# Altium project HAB-Payload-Card-Template.PrjPcb
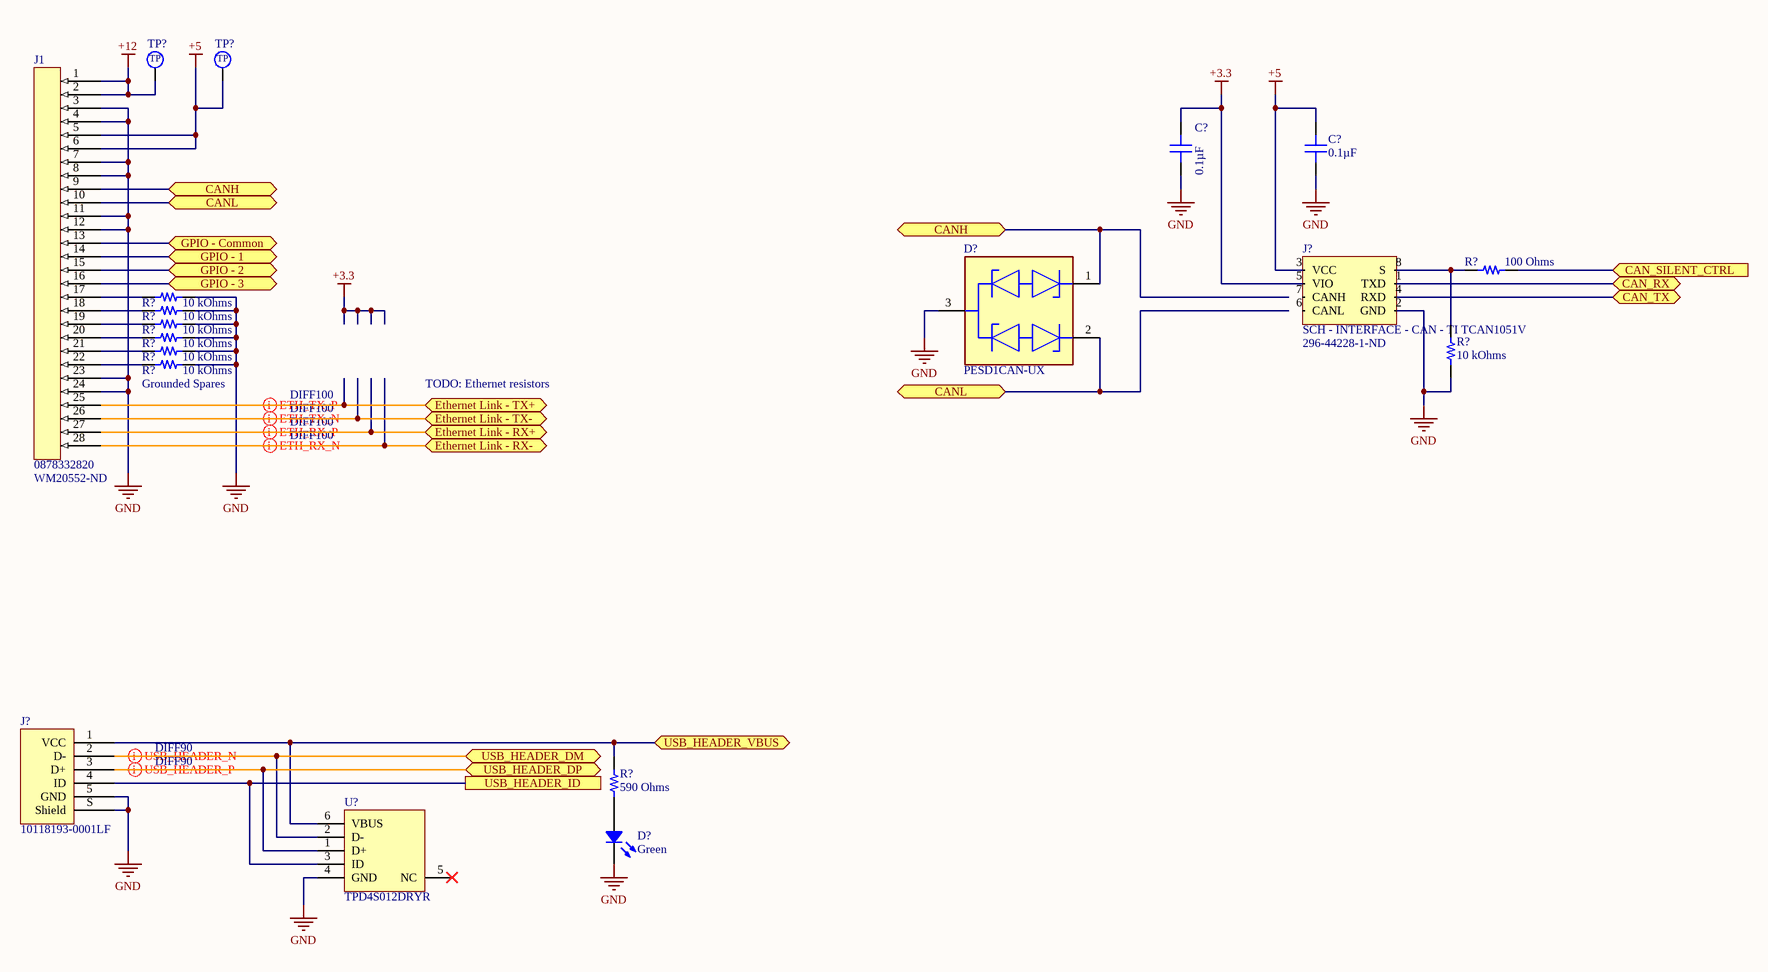
[diagram p0: Payload-Card-Template.SchDoc]
3 sheets, 67 parts. Net scope: flat (ports and power ports of the same name join across sheets).
Board file: Payload-Card-Template.PcbDoc
Sheets:
  Payload-Card-Template.SchDoc
  Microcontroller.SchDoc
  Power-Supplies.SchDoc

## Sheet Payload-Card-Template.SchDoc
size A3; Organization: Altium Limited; Address1: L3, 12a Rodborough Rd; Address2: Frenchs Forest; Address3: NSW; Address4: Australia 2086

### Parts
(Parts that share a designator on the sheet are numbered #1, #2 ... from top to bottom, then left to right.)
C?#1  0.1µF  [CAP 0603_1608]
C?#2  0.1µF  [CAP 0603_1608]
D?#1  PESD1CAN-UX  [FP-SOT323-MFG]
D?#2  Green  [LED 0603_1608 GREEN]
J1  0878332820  Supplier Part Number 1: WM20552-ND  [0878332820]
J?#1  SCH - INTERFACE - CAN - TI TCAN1051V  Supplier Part Number 1: 296-44228-1-ND
J?#2  10118193-0001LF  [FCI USB 10118193-0001LF]
R?#1  100 Ohms  [RES 0603_1608]
R?#2  10 kOhms  [RES 0603_1608]
R?#3  10 kOhms  [RES 0603_1608]
R?#4  10 kOhms  [RES 0603_1608]
R?#5  10 kOhms  [RES 0603_1608]
R?#6  10 kOhms  [RES 0603_1608]
R?#7  10 kOhms  [RES 0603_1608]
R?#8  10 kOhms  [RES 0603_1608]
R?#9  590 Ohms  [RES 0603_1608]
TP?#1  2.5mm_SMD_TestPoint  [2.5mm TestPoint]  (value not drawn)
TP?#2  2.5mm_SMD_TestPoint  [2.5mm TestPoint]  (value not drawn)
U?#1  TPD4S012DRYR  [DRY0006A]

### Ports
CAN_RX (bidir), CAN_SILENT_CTRL (in), CAN_TX (bidir), CANH (bidir), CANL (bidir), Ethernet Link - RX+ (bidir), Ethernet Link - RX- (bidir), Ethernet Link - TX+ (bidir), Ethernet Link - TX- (bidir), GPIO - 1 (bidir), GPIO - 2 (bidir), GPIO - 3 (bidir), GPIO - Common (bidir), USB_HEADER_DM (bidir), USB_HEADER_DP (bidir), USB_HEADER_ID, USB_HEADER_VBUS (bidir)

### Nets
+3.3: C?#1.2 J?#1.5(VIO)
+5: C?#2.2 J1.5 J1.6 J?#1.3(VCC) TP?#2.1
+12: J1.1 J1.2 TP?#1.1
GND: C?#1.1 C?#2.1 D?#1.3(common_cathode) D?#2.2 J1.3 J1.4 J1.7 J1.8 J1.11 J1.12 J1.23 J1.24 J?#1.2(GND) J?#2.5(GND) J?#2.S(Shield) R?#2.2 R?#3.2 R?#4.2 R?#5.2 R?#6.2 R?#7.1 R?#8.2 U?#1.4(GND)
NetD?#1_1: D?#1.1(cathode_1) J1.9 ; port CANH
NetD?#1_2: D?#1.2(cathode_2) J1.10 ; port CANL
NetD?#2_1: D?#2.1 R?#9.1
NetJ1_13: J1.13 ; port GPIO - Common
NetJ1_14: J1.14 ; port GPIO - 1
NetJ1_15: J1.15 ; port GPIO - 2
NetJ1_16: J1.16 ; port GPIO - 3
NetJ1_17: J1.17 R?#2.1
NetJ1_18: J1.18 R?#3.1
NetJ1_19: J1.19 R?#4.1
NetJ1_20: J1.20 R?#5.1
NetJ1_21: J1.21 R?#6.1
NetJ1_22: J1.22 R?#8.1
NetJ1_25: J1.25 ; port Ethernet Link - TX+
NetJ1_26: J1.26 ; port Ethernet Link - TX-
NetJ1_27: J1.27 ; port Ethernet Link - RX+
NetJ1_28: J1.28 ; port Ethernet Link - RX-
NetJ?#1_1: J?#1.1(TXD) ; port CAN_RX
NetJ?#1_4: J?#1.4(RXD) ; port CAN_TX
NetJ?#1_8: J?#1.8(S) R?#1.1 R?#7.2
NetJ?#2_1: J?#2.1(VCC) R?#9.2 U?#1.6(VBUS) ; port USB_HEADER_VBUS
NetJ?#2_2: J?#2.2(D-) U?#1.2(D-) ; port USB_HEADER_DM
NetJ?#2_3: J?#2.3(D+) U?#1.1(D+) ; port USB_HEADER_DP
NetJ?#2_4: J?#2.4(ID) U?#1.3(ID) ; port USB_HEADER_ID
NetR?#1_2: R?#1.2 ; port CAN_SILENT_CTRL

Not connected (* = marked no-connect by the designer): J?#1 6(CANL) 7(CANH); U?#1 5(NC)*

### Layout directives
differential pair; differential pair class DIFF100: NetJ1_25, NetJ1_26, NetJ1_27, NetJ1_28
differential pair; differential pair class DIFF90: NetJ?#2_2, NetJ?#2_3

### Notes on the sheet
- (near R?#8) Grounded Spares
- TODO: Ethernet resistors
- Title
- Size:
- Date:
- A3
- Number:
- Time:
- Revision:
- Sheet
- of
- File:
- (in symbol 2.5mm_SMD_TestPoint) TP

### Library data of the parts
C?#1 C?#2 = CL10B104KA8WPNC: CAP CER 0.1UF 25V X7R 0603; Manufacturer: Samsung Electro-Mechanics; Tolerance: ±10%; Part Number: CL10B104KA8WPNC; Value: 0.1µF; Applications: Automotive; Capacitance: 0.1µF; ComponentLink1Description: Datasheet; ComponentLink1URL: http://www.samsungsem.com/kr/support/product-search/mlcc/CL10B104KA8WPNC.jsp; ComponentLink2Description: DigiKey Link; ComponentLink2URL: http://digikey.com/product-detail/en/samsung-electro-mechanics/CL10B104KA8WPNC/1276-6717-1-ND/5961576; Device Package: 0603 (1608 Metric); Features: Open Mode; LastUpdated: 9/2/2020 1:03:30 AM; Lifecycle Status: Active; Minimum Order: 1; Mounting Type: Surface Mount, MLCC; Operating Temperature: -55°C ~ 125°C; Package / Case: 0603 (1608 Metric); Packaging: TapeAndReel; PartId: 5631; Part Status: Active; Price: 0.02; Ratings: AEC-Q200; Series: CL; Size / Dimension: 0.063" L x 0.031" W (1.60mm x 0.80mm); Supplier 1: DigiKey; Supplier Part Number 1: 1276-6717-1-ND; Temperature Coefficient: X7R; Thickness (Max): 0.035" (0.90mm); Voltage - Rated: 25V
D?#1 = CMP-14436-000006-1: TVS DIODE 24V 50V SC70-3
D?#2 = LTST-C193KGKT-5A: LED GREEN CLEAR CHIP SMD; Manufacturer: Lite-On Inc.; Configuration: Standard; Current - Test: 5mA; Lens Color: Colorless; Lens Size: 1.15mm x 0.80mm; Lens Style: Rectangle with Flat Top; Millicandela Rating: 16.25mcd; Viewing Angle: 130°; Voltage - Forward (Vf) (Typ): 2V; Wavelength - Dominant: 572nm; Wavelength - Peak: 574nm; Part Number: LTST-C193KGKT-5A; Color: Green; ComponentLink1Description: Datasheet; ComponentLink1URL: http://optoelectronics.liteon.com/upload/download/DS22-2007-0094/LTST-C193KGKT-5A.PDF; ComponentLink2Description: DigiKey Link; ComponentLink2URL: http://digikey.com/product-detail/en/lite-on-inc/LTST-C193KGKT-5A/160-1828-1-ND/2356247; Device Package: 0603 (1608 Metric); Height (Max): 0.45mm; LastUpdated: 9/2/2020 1:20:41 AM; Lens Transparency: Clear; Lifecycle Status: Active; Minimum Order: 1; Mounting Type: Surface Mount; Package / Case: 0603 (1608 Metric); Packaging: TapeAndReel; PartId: 694; Part Status: Active; Price: 0.06; Series: -; Size / Dimension: 1.60mm L x 0.80mm W; Supplier 1: DigiKey; Supplier Part Number 1: 160-1828-1-ND; Supplier Device Package: Chip LED; Value: Green
J?#2 = 10118193-0001LF: CONN RCPT USB2.0 MICRO B SMD R/A; Manufacturer: Amphenol ICC (FCI); Connector Type: USB - micro B; Current Rating (Amps): 1.8A per Contact; Gender: Receptacle; Mating Cycles: 10000; Number of Contacts: 5; Number of Ports: 1; Shielding: Shielded; Voltage - Rated: 100VAC; Part Number: 10118193-0001LF; ComponentLink1Description: Datasheet; ComponentLink1URL: https://cdn.amphenol-icc.com/media/wysiwyg/files/documentation/datasheet/inputoutput/io_usb_micro.pdf; ComponentLink2Description: DigiKey Link; ComponentLink2URL: //digikey.com/product-detail/en/amphenol-icc-fci/10118193-0001LF/609-4616-2-ND/2785388; Features: Solder Retention; LastUpdated: 12/9/2019 8:51:28 PM; Lifecycle Status: 0; Minimum Order: 1; Mounting Feature: Horizontal; Mounting Type: Surface Mount, Right Angle; Through Hole; Operating Temperature: -30°C ~ 80°C; Packaging: TapeAndReel; Part Status: Active; Price: 0.21; Series: -; Specifications: USB 2.0; Supplier 1: DigiKey; Supplier Part Number 1: 609-4616-2-ND; Termination: Solder
R?#1 = RMCF0603FG100R: RES 100 OHM 1% 1/10W 0603; Manufacturer: Stackpole Electronics Inc; Power (Watts): 0.1W, 1/10W; Temperature Coefficient: ±100ppm/°C; Part Number: RMCF0603FG100R; Value: 100 Ohms; ComponentLink1Description: Datasheet; ComponentLink1URL: https://www.seielect.com/catalog/sei-rmcf_rmcp.pdf; ComponentLink2Description: DigiKey Link; ComponentLink2URL: http://digikey.com/product-detail/en/stackpole-electronics-inc/RMCF0603FG100R/RMCF0603FG100RCT-ND/4425033; Composition: Thick Film; Device Package: 0603 (1608 Metric); Features: Automotive AEC-Q200; Height - Seated (Max): 0.022" (0.55mm); LastUpdated: 9/2/2020 1:09:39 AM; Lifecycle Status: Active; Minimum Order: 1; Number of Terminations: 2; Operating Temperature: -55°C ~ 155°C; Package / Case: 0603 (1608 Metric); Packaging: CutTape; PartId: 24036; Part Status: Active; Price: 0.10; Ratings: AEC-Q200; Resistance: 100 Ohms; Series: RMCF; Size / Dimension: 0.061" L x 0.031" W (1.55mm x 0.80mm); Supplier 1: DigiKey; Supplier Part Number 1: RMCF0603FG100RCT-ND; Supplier Device Package: 0603; Tolerance: ±1%
R?#2-R?#6 R?#8 = RMCF0603JT10K0: RES 10K OHM 5% 1/10W 0603; Manufacturer: Stackpole Electronics Inc; Power (Watts): 0.1W, 1/10W; Temperature Coefficient: ±200ppm/°C; Part Number: RMCF0603JT10K0; Value: 10 kOhms; ComponentLink1Description: Datasheet; ComponentLink1URL: https://www.seielect.com/catalog/sei-packaging.pdf; ComponentLink2Description: DigiKey Link; ComponentLink2URL: http://digikey.com/product-detail/en/stackpole-electronics-inc/RMCF0603JT10K0/RMCF0603JT10K0CT-ND/1943191; Composition: Thick Film; Device Package: 0603 (1608 Metric); Features: Automotive AEC-Q200; Height - Seated (Max): 0.022" (0.55mm); LastUpdated: 8/30/2020 8:48:45 PM; Lifecycle Status: Active; Minimum Order: 1; Number of Terminations: 2; Operating Temperature: -55°C ~ 155°C; Package / Case: 0603 (1608 Metric); Packaging: CutTape; PartId: 25659; Part Status: Active; Price: 0.10; Ratings: AEC-Q200; Resistance: 10 kOhms; Series: RMCF; Size / Dimension: 0.061" L x 0.031" W (1.55mm x 0.80mm); Supplier 1: DigiKey; Supplier Part Number 1: RMCF0603JT10K0CT-ND; Supplier Device Package: 0603; Tolerance: ±5%
R?#7 = RNCP0603FTD10K0: RES 10K OHM 1% 1/8W 0603; Manufacturer: Stackpole Electronics Inc; Power (Watts): 0.125W, 1/8W; Temperature Coefficient: ±100ppm/°C; Part Number: RNCP0603FTD10K0; Value: 10 kOhms; ComponentLink1Description: Datasheet; ComponentLink1URL: https://www.seielect.com/catalog/sei-rncp.pdf; ComponentLink2Description: DigiKey Link; ComponentLink2URL: http://digikey.com/product-detail/en/stackpole-electronics-inc/RNCP0603FTD10K0/RNCP0603FTD10K0CT-ND/2240478; Composition: Thin Film; Device Package: 0603 (1608 Metric); Features: Anti-Sulfur, Moisture Resistant; Height - Seated (Max): 0.020" (0.50mm); LastUpdated: 9/2/2020 1:09:45 AM; Lifecycle Status: Active; Minimum Order: 1; Number of Terminations: 2; Operating Temperature: -55°C ~ 155°C; Package / Case: 0603 (1608 Metric); Packaging: TapeAndReel; PartId: 22616; Part Status: Active; Price: 0.01; Resistance: 10 kOhms; Series: RNCP; Size / Dimension: 0.059" L x 0.031" W (1.50mm x 0.80mm); Supplier 1: DigiKey; Supplier Part Number 1: RNCP0603FTD10K0CT-ND; Supplier Device Package: 0603; Tolerance: ±1%
R?#9 = RMCF0603FT590R: RES 590 OHM 1% 1/10W 0603; Manufacturer: Stackpole Electronics Inc; Power (Watts): 0.1W, 1/10W; Temperature Coefficient: ±100ppm/°C; Part Number: RMCF0603FT590R; Value: 590 Ohms; ComponentLink1Description: Datasheet; ComponentLink1URL: https://www.seielect.com/catalog/sei-rmcf_rmcp.pdf; ComponentLink2Description: DigiKey Link; ComponentLink2URL: http://digikey.com/product-detail/en/stackpole-electronics-inc/RMCF0603FT590R/RMCF0603FT590RCT-ND/2418096; Composition: Thick Film; Device Package: 0603 (1608 Metric); Features: Automotive AEC-Q200; Height - Seated (Max): 0.022" (0.55mm); LastUpdated: 9/2/2020 1:09:40 AM; Lifecycle Status: Active; Minimum Order: 1; Number of Terminations: 2; Operating Temperature: -55°C ~ 155°C; Package / Case: 0603 (1608 Metric); Packaging: CutTape; PartId: 23847; Part Status: Active; Price: 0.10; Ratings: AEC-Q200; Resistance: 590 Ohms; Series: RMCF; Size / Dimension: 0.061" L x 0.031" W (1.55mm x 0.80mm); Supplier 1: DigiKey; Supplier Part Number 1: RMCF0603FT590RCT-ND; Supplier Device Package: 0603; Tolerance: ±1%
U?#1 = CMP-0326-00038-3: USB ESD Solution with Power Clamp, 4 Channels, -40 to +85 degC, 6-pin SON (DRY), Green (RoHS & no Sb/Br); Manufacturer: Texas Instruments; IO Capacitance(Typ)(pF): 0.8; USB High Speed: TRUE; IEC 61000-4-2 Air-Gap(+/- kV): 10; Breakdown Voltage(Min)(V): 6; PackageDescription: 6-Pin Plastic Small Outline No-Lead, 1 x 1.45 x 0.6 mm Body, 0.5 mm Pitch; ComponentLink2URL: http://www.ti.com/general/docs/lit/getliterature.tsp?genericPartNumber=TPD4S012&fileType=pdf; PackageVersion: revF, Dec-2011; ComponentLink3URL: SamplesURL:http://www.ti.com/product/tpd4s012#samples; ComponentLink2Description: Datasheet; IEC 61000-4-2 Contact(+/- kV): 10; DatasheetVersion: SLVS928A; PackageReference: DRY0006A; ComponentLink3Description: URL Link1; Mounting Technology: Surface Mount; PartNumber: TPD4S012DRYR; ComponentLink1Description: Manufacturer URL; SubFamily: ESD Solution; IO Leakage Current(nA): 10; ComponentLink1URL: http://www.ti.com/; Eco-Plan: Green (RoHS & no Sb/Br)
J1 = 0878332820: Supplier 1: Digi-Key
J?#1 = SCH - INTERFACE - CAN - TI TCAN1051V: Supplier 1: Digi-Key

## Sheet Microcontroller.SchDoc
size A2; Organization: Altium Limited; Address1: L3, 12a Rodborough Rd; Address2: Frenchs Forest; Address3: NSW; Address4: Australia 2086
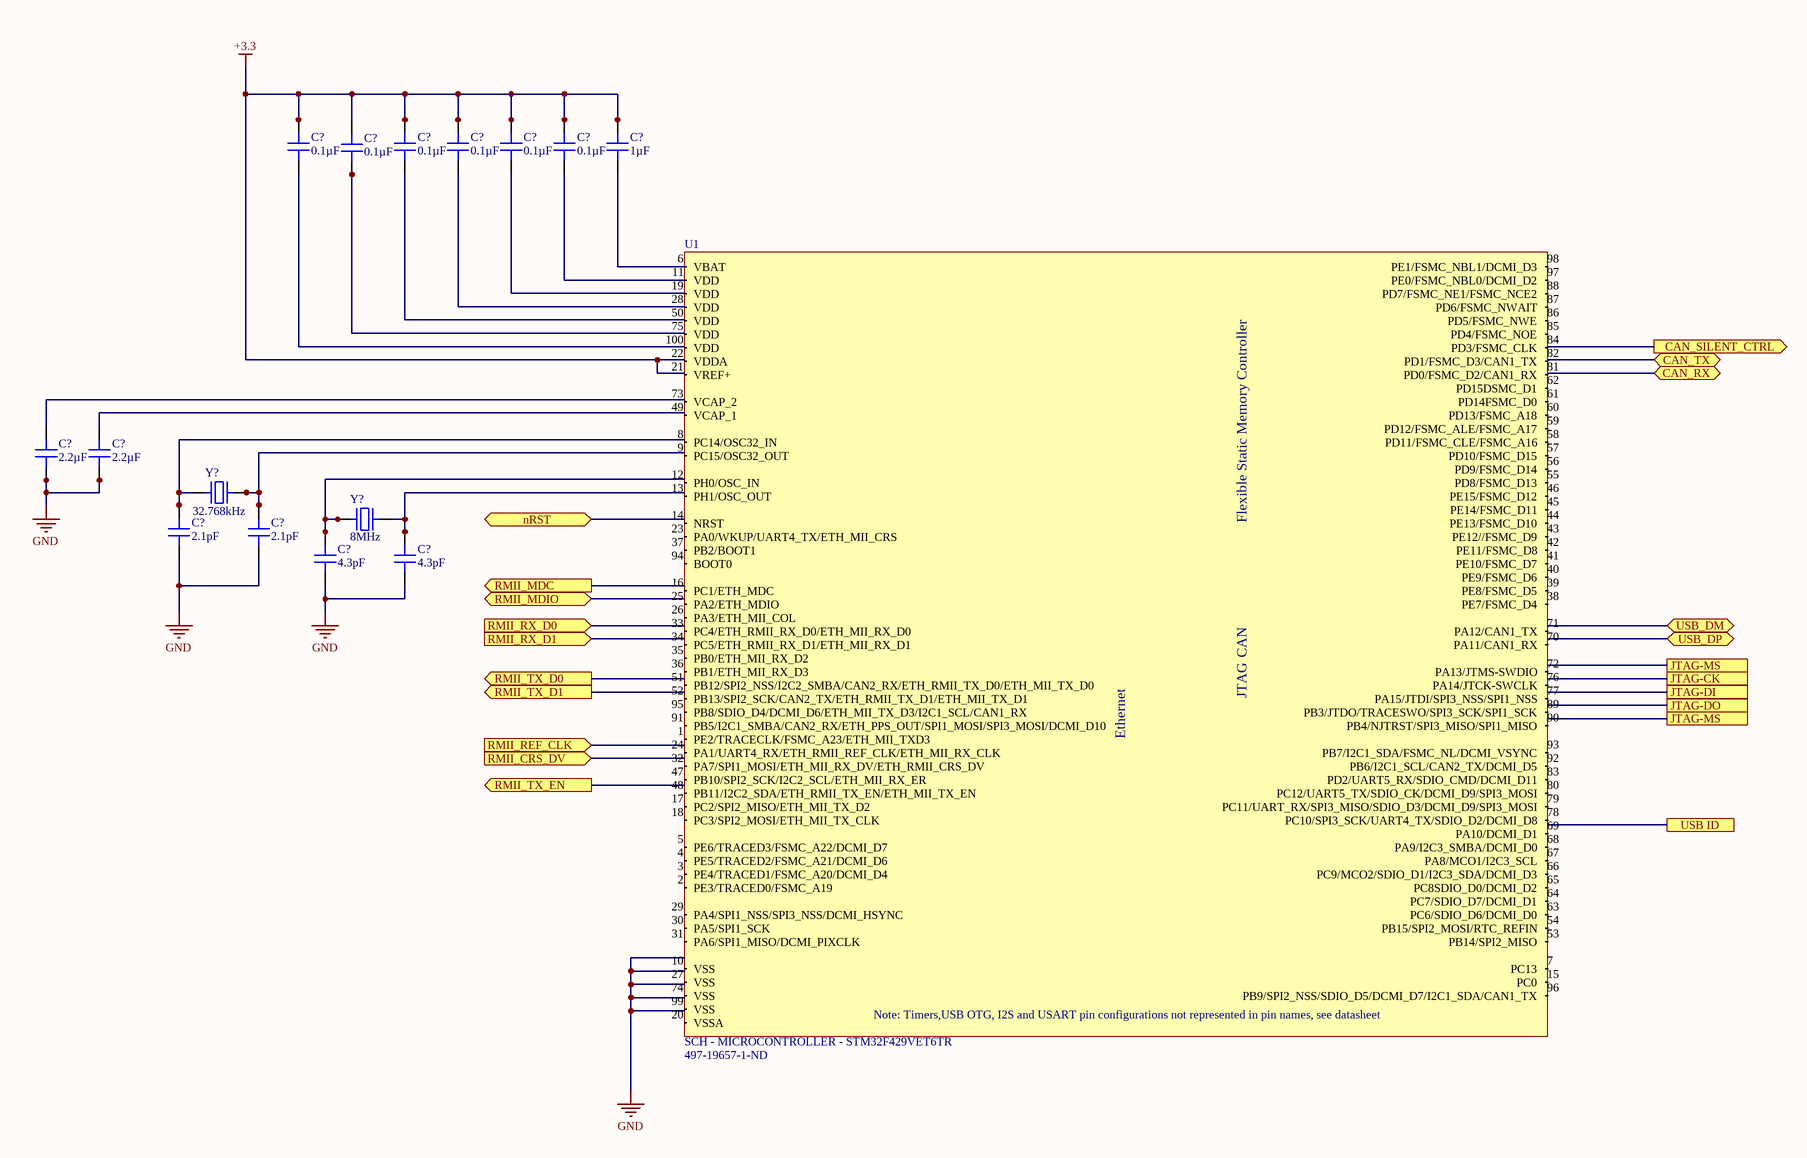
[diagram p1: Microcontroller.SchDoc]

### Parts
(Parts that share a designator on the sheet are numbered #1, #2 ... from top to bottom, then left to right.)
C?#3  0.1µF  [CAP 0603_1608]
C?#4  0.1µF  [CAP 0603_1608]
C?#5  0.1µF  [CAP 0603_1608]
C?#6  0.1µF  [CAP 0603_1608]
C?#7  0.1µF  [CAP 0603_1608]
C?#8  0.1µF  [CAP 0603_1608]
C?#9  1µF  [CAP 0603_1608]
C?#10  2.2µF  [CAP 0603_1608]
C?#11  2.2µF  [CAP 0603_1608]
C?#12  2.1pF  [CAP 0603_1608]
C?#13  2.1pF  [CAP 0603_1608]
C?#14  4.3pF  [CAP 0603_1608]
C?#15  4.3pF  [CAP 0603_1608]
U1  SCH - MICROCONTROLLER - STM32F429VET6TR  Supplier Part Number 1: 497-19657-1-ND  [PCB - LEADLESS - LQFP - ST LQFP-100 14X14MM]
Y?#1  32.768kHz  [ABRACON ABS07]
Y?#2  8MHz  [NDK NX8045GB]

### Ports
CAN_RX (bidir), CAN_SILENT_CTRL (out), CAN_TX (bidir), JTAG-CK, JTAG-DI, JTAG-DO, JTAG-MS, nRST (bidir), RMII_CRS_DV (in), RMII_MDC (out), RMII_MDIO (bidir), RMII_REF_CLK (in), RMII_RX_D0 (in), RMII_RX_D1 (in), RMII_TX_D0 (out), RMII_TX_D1 (out), RMII_TX_EN (out), USB ID, USB_DM (bidir), USB_DP (bidir)

### Nets
+3.3: C?#3.2 C?#4.2 C?#5.2 C?#6.2 C?#7.2 C?#8.2 C?#9.2
GND: C?#10.1 C?#11.1 C?#12.1 C?#13.1 C?#14.1 C?#15.1
NetC?#7_1: C?#7.1 U1.19(VDD)
NetC?#8_1: C?#8.1 U1.11(VDD)
NetC?#9_1: C?#9.1 U1.6(VBAT)
NetC?#12_2: C?#12.2 Y?#1.1
NetC?#13_2: C?#13.2 Y?#1.2
NetC?#14_2: C?#14.2 Y?#2.1
NetC?#15_2: C?#15.2 Y?#2.2

Not connected (* = marked no-connect by the designer): C?#3 1; C?#4 1; C?#5 1; C?#6 1; C?#10 2; C?#11 2; U1 1(PE2/TRACECLK/FSMC_A23/ETH_MII_TXD3) 2(PE3/TRACED0/FSMC_A19) 3(PE4/TRACED1/FSMC_A20/DCMI_D4) 4(PE5/TRACED2/FSMC_A21/DCMI_D6) 5(PE6/TRACED3/FSMC_A22/DCMI_D7) 7(PC13) 8(PC14/OSC32_IN) 9(PC15/OSC32_OUT) 10(VSS) 12(PH0/OSC_IN) 13(PH1/OSC_OUT) 14(NRST) 15(PC0) 16(PC1/ETH_MDC) 17(PC2/SPI2_MISO/ETH_MII_TX_D2) 18(PC3/SPI2_MOSI/ETH_MII_TX_CLK) 20(VSSA) 21(VREF+) 22(VDDA) 23(PA0/WKUP/UART4_TX/ETH_MII_CRS) 24(PA1/UART4_RX/ETH_RMII_REF_CLK/ETH_MII_RX_CLK) 25(PA2/ETH_MDIO) 26(PA3/ETH_MII_COL) 27(VSS) 28(VDD) 29(PA4/SPI1_NSS/SPI3_NSS/DCMI_HSYNC) 30(PA5/SPI1_SCK) 31(PA6/SPI1_MISO/DCMI_PIXCLK) 32(PA7/SPI1_MOSI/ETH_MII_RX_DV/ETH_RMII_CRS_DV) 33(PC4/ETH_RMII_RX_D0/ETH_MII_RX_D0) 34(PC5/ETH_RMII_RX_D1/ETH_MII_RX_D1) 35(PB0/ETH_MII_RX_D2) 36(PB1/ETH_MII_RX_D3) 37(PB2/BOOT1) 38(PE7/FSMC_D4) 39(PE8/FSMC_D5) 40(PE9/FSMC_D6) 41(PE10/FSMC_D7) 42(PE11/FSMC_D8) 43(PE12//FSMC_D9) 44(PE13/FSMC_D10) 45(PE14/FSMC_D11) 46(PE15/FSMC_D12) 47(PB10/SPI2_SCK/I2C2_SCL/ETH_MII_RX_ER) 48(PB11/I2C2_SDA/ETH_RMII_TX_EN/ETH_MII_TX_EN) 49(VCAP_1) 50(VDD) 51(PB12/SPI2_NSS/I2C2_SMBA/CAN2_RX/ETH_RMII_TX_D0/ETH_MII_TX_D0) 52(PB13/SPI2_SCK/CAN2_TX/ETH_RMII_TX_D1/ETH_MII_TX_D1) 53(PB14/SPI2_MISO) 54(PB15/SPI2_MOSI/RTC_REFIN) 55(PD8/FSMC_D13) 56(PD9/FSMC_D14) 57(PD10/FSMC_D15) 58(PD11/FSMC_CLE/FSMC_A16) 59(PD12/FSMC_ALE/FSMC_A17) 60(PD13/FSMC_A18) 61(PD14FSMC_D0) 62(PD15DSMC_D1) 63(PC6/SDIO_D6/DCMI_D0) 64(PC7/SDIO_D7/DCMI_D1) 65(PC8SDIO_D0/DCMI_D2) 66(PC9/MCO2/SDIO_D1/I2C3_SDA/DCMI_D3) 67(PA8/MCO1/I2C3_SCL) 68(PA9/I2C3_SMBA/DCMI_D0) 69(PA10/DCMI_D1) 70(PA11/CAN1_RX) 71(PA12/CAN1_TX) 72(PA13/JTMS-SWDIO) 73(VCAP_2) 74(VSS) 75(VDD) 76(PA14/JTCK-SWCLK) 77(PA15/JTDI/SPI3_NSS/SPI1_NSS) 78(PC10/SPI3_SCK/UART4_TX/SDIO_D2/DCMI_D8) 79(PC11/UART_RX/SPI3_MISO/SDIO_D3/DCMI_D9/SPI3_MOSI) 80(PC12/UART5_TX/SDIO_CK/DCMI_D9/SPI3_MOSI) 81(PD0/FSMC_D2/CAN1_RX) 82(PD1/FSMC_D3/CAN1_TX) 83(PD2/UART5_RX/SDIO_CMD/DCMI_D11) 84(PD3/FSMC_CLK) 85(PD4/FSMC_NOE) 86(PD5/FSMC_NWE) 87(PD6/FSMC_NWAIT) 88(PD7/FSMC_NE1/FSMC_NCE2) 89(PB3/JTDO/TRACESWO/SPI3_SCK/SPI1_SCK) 90(PB4/NJTRST/SPI3_MISO/SPI1_MISO) 91(PB5/I2C1_SMBA/CAN2_RX/ETH_PPS_OUT/SPI1_MOSI/SPI3_MOSI/DCMI_D10) 92(PB6/I2C1_SCL/CAN2_TX/DCMI_D5) 93(PB7/I2C1_SDA/FSMC_NL/DCMI_VSYNC) 94(BOOT0) 95(PB8/SDIO_D4/DCMI_D6/ETH_MII_TX_D3/I2C1_SCL/CAN1_RX) 96(PB9/SPI2_NSS/SDIO_D5/DCMI_D7/I2C1_SDA/CAN1_TX) 97(PE0/FSMC_NBL0/DCMI_D2) 98(PE1/FSMC_NBL1/DCMI_D3) 99(VSS) 100(VDD)

### Notes on the sheet
- Title
- Size:
- Date:
- File:
- A2
- Number:
- Time:
- Revision:
- Sheet
- of
- (in symbol SCH - MICROCONTROLLER - STM32F429VET6TR) Flexible Static Memory Controller; CAN; JTAG; Ethernet; Note: Timers,USB OTG, I2S and USART pin configurations not represented in pin names, see datasheet

### Library data of the parts
C?#3-C?#8 = VJ0603Y104KXJCW1BC: CAP CER 0.1UF 16V X7R 0603; Manufacturer: Vishay Vitramon; Tolerance: ±10%; Part Number: VJ0603Y104KXJCW1BC; Value: 0.1µF; Applications: General Purpose; Capacitance: 0.1µF; ComponentLink1Description: Datasheet; ComponentLink1URL: https://www.vishay.com/docs/28548/vjw1bcbascomseries.pdf; ComponentLink2Description: DigiKey Link; ComponentLink2URL: http://digikey.com/product-detail/en/vishay-vitramon/VJ0603Y104KXJCW1BC/720-1532-1-ND/421011; Device Package: 0603 (1608 Metric); LastUpdated: 9/2/2020 1:03:10 AM; Lifecycle Status: Active; Minimum Order: 1; Mounting Type: Surface Mount, MLCC; Operating Temperature: -55°C ~ 125°C; Package / Case: 0603 (1608 Metric); Packaging: TapeAndReel; PartId: 15347; Part Status: Active; Price: 0.03; Series: VJ; Size / Dimension: 0.063" L x 0.031" W (1.60mm x 0.80mm); Supplier 1: DigiKey; Supplier Part Number 1: 720-1532-1-ND; Temperature Coefficient: X7R; Thickness (Max): 0.035" (0.90mm); Voltage - Rated: 16V
C?#9 = GCM188R71C105KA64J: CAP CER 1UF 16V X7R 0603; Manufacturer: Murata Electronics; Tolerance: ±10%; Part Number: GCM188R71C105KA64J; Value: 1µF; Applications: Automotive; Capacitance: 1µF; ComponentLink1Description: Datasheet; ComponentLink1URL: https://www.murata.com/~/media/webrenewal/support/library/catalog/products/capacitor/mlcc/c03e.ashx?la=en-us; ComponentLink2Description: DigiKey Link; ComponentLink2URL: http://digikey.com/product-detail/en/murata-electronics/GCM188R71C105KA64J/490-12657-1-ND/5797626; Device Package: 0603 (1608 Metric); LastUpdated: 9/2/2020 1:03:14 AM; Lifecycle Status: Active; Minimum Order: 1; Mounting Type: Surface Mount, MLCC; Operating Temperature: -55°C ~ 125°C; Package / Case: 0603 (1608 Metric); Packaging: TapeAndReel; PartId: 13992; Part Status: Active; Price: 0.03; Ratings: AEC-Q200; Series: GCM; Size / Dimension: 0.063" L x 0.031" W (1.60mm x 0.80mm); Supplier 1: DigiKey; Supplier Part Number 1: 490-12657-1-ND; Temperature Coefficient: X7R; Thickness (Max): 0.035" (0.90mm); Voltage - Rated: 16V
C?#10 C?#11 = EMK107BJ225KA-T: CAP CER 2.2UF 16V X5R 0603; Manufacturer: Taiyo Yuden; Tolerance: ±10%; Part Number: EMK107BJ225KA-T; Value: 2.2µF; Applications: General Purpose; Capacitance: 2.2µF; ComponentLink1Description: Datasheet; ComponentLink1URL: https://ds.yuden.co.jp/TYCOMPAS/ut/detail?pn=EMK107BJ225KA-T  &u=M; ComponentLink2Description: DigiKey Link; ComponentLink2URL: http://digikey.com/product-detail/en/taiyo-yuden/EMK107BJ225KA-T/587-1430-1-ND/1004061; Device Package: 0603 (1608 Metric); LastUpdated: 9/2/2020 1:03:30 AM; Lifecycle Status: Active; Minimum Order: 1; Mounting Type: Surface Mount, MLCC; Operating Temperature: -55°C ~ 85°C; Package / Case: 0603 (1608 Metric); Packaging: TapeAndReel; PartId: 5619; Part Status: Active; Price: 0.02; Series: M; Size / Dimension: 0.063" L x 0.031" W (1.60mm x 0.80mm); Supplier 1: DigiKey; Supplier Part Number 1: 587-1430-1-ND; Temperature Coefficient: X5R; Thickness (Max): 0.035" (0.90mm); Voltage - Rated: 16V
C?#12 C?#13 = CBR06C219B5GAC: CAP CER RF 2.1PF 50V +/-0.1 PF C; Manufacturer: KEMET; Temperature Coefficient: C0G, NP0; Tolerance: ±0.1pF; Part Number: CBR06C219B5GAC; Value: 2.1pF; Applications: RF, Microwave, High Frequency; Capacitance: 2.1pF; ComponentLink1Description: Datasheet; ComponentLink1URL: https://api.kemet.com/component-edge/download/datasheet/CBR06C219B5GAC.pdf; ComponentLink2Description: DigiKey Link; ComponentLink2URL: http://digikey.com/product-detail/en/kemet/CBR06C219B5GAC/399-16153-1-ND/7649738; Device Package: 0603 (1608 Metric); Features: High Q, Low Loss, Ultra Low ESR; LastUpdated: 9/2/2020 1:03:15 AM; Lifecycle Status: Active; Minimum Order: 1; Mounting Type: Surface Mount, MLCC; Operating Temperature: -55°C ~ 125°C; Package / Case: 0603 (1608 Metric); Packaging: TapeAndReel; PartId: 13663; Part Status: Active; Price: 0.05; Series: CBR-SMD RF C0G; Size / Dimension: 0.063" L x 0.031" W (1.60mm x 0.80mm); Supplier 1: DigiKey; Supplier Part Number 1: 399-16153-1-ND; Thickness (Max): 0.034" (0.87mm); Voltage - Rated: 50V
C?#14 C?#15 = CBR06C439B5GAC: CAP CER RF 4.3PF 50V +/-0.1 PF C; Manufacturer: KEMET; Temperature Coefficient: C0G, NP0; Tolerance: ±0.1pF; Part Number: CBR06C439B5GAC; Value: 4.3pF; Applications: RF, Microwave, High Frequency; Capacitance: 4.3pF; ComponentLink1Description: Datasheet; ComponentLink1URL: https://api.kemet.com/component-edge/download/datasheet/CBR06C439B5GAC.pdf; ComponentLink2Description: DigiKey Link; ComponentLink2URL: http://digikey.com/product-detail/en/kemet/CBR06C439B5GAC/399-16185-1-ND/7649770; Device Package: 0603 (1608 Metric); Features: High Q, Low Loss, Ultra Low ESR; LastUpdated: 9/2/2020 1:03:25 AM; Lifecycle Status: Active; Minimum Order: 1; Mounting Type: Surface Mount, MLCC; Operating Temperature: -55°C ~ 125°C; Package / Case: 0603 (1608 Metric); Packaging: TapeAndReel; PartId: 8283; Part Status: Active; Price: 0.05; Series: CBR-SMD RF C0G; Size / Dimension: 0.063" L x 0.031" W (1.60mm x 0.80mm); Supplier 1: DigiKey; Supplier Part Number 1: 399-16185-1-ND; Thickness (Max): 0.034" (0.87mm); Voltage - Rated: 50V
Y?#1 = ABS07-166-32.768KHZ-T: IOT 32.786KHZ XTAL; Manufacturer: Abracon LLC; ESR (Equivalent Series Resistance): 70 kOhms; Frequency Tolerance: ±10ppm; Load Capacitance: 7pF; Operating Mode: Fundamental; Part Number: ABS07-166-32.768KHZ-T; ComponentLink1Description: Datasheet; ComponentLink1URL: https://abracon.com/datasheets/ABS07-166-32.768kHz-T.pdf; ComponentLink2Description: DigiKey Link; ComponentLink2URL: http://digikey.com/product-detail/en/abracon-llc/ABS07-166-32.768KHZ-T/535-14514-1-ND/8827205; Frequency: 32.768kHz; Height - Seated (Max): 0.035" (0.90mm); LastUpdated: 9/2/2020 1:21:47 AM; Lifecycle Status: Active; Minimum Order: 1; Mounting Type: Surface Mount; Operating Temperature: -40°C ~ 85°C; Package / Case: 2-SMD, No Lead; Packaging: TapeAndReel; PartId: 384; Part Status: Active; Price: 0.35; Series: ABS07; Size / Dimension: 0.126" L x 0.059" W (3.20mm x 1.50mm); Supplier 1: DigiKey; Supplier Part Number 1: 535-14514-1-ND; Type: kHz Crystal (Tuning Fork); Value: 32.768kHz
Y?#2 = NX8045GB-8.000000MHZ: CRYSTAL 8.0000MHZ 8PF SMD; Manufacturer: NDK America, Inc.; ESR (Equivalent Series Resistance): 200 Ohms; Frequency Stability: ±50ppm; Operating Mode: Fundamental; Part Number: NX8045GB-8.000000MHZ; ComponentLink1Description: Datasheet; ComponentLink1URL: //media.digikey.com/pdf/Data%20Sheets/NDK%20PDFs/NX8045GB.pdf; ComponentLink2Description: DigiKey Link; ComponentLink2URL: http://digikey.com/product-detail/en/ndk-america-inc/NX8045GB-8.000000MHZ/644-1018-1-ND/1128890; Frequency: 8MHz; Frequency Tolerance: ±50ppm; Height - Seated (Max): 0.079" (2.00mm); LastUpdated: 9/2/2020 1:22:00 AM; Lifecycle Status: Active; Load Capacitance: 8pF; Minimum Order: 1; Mounting Type: Surface Mount; Operating Temperature: -10°C ~ 70°C; Package / Case: 2-SMD, No Lead; Packaging: TapeAndReel; PartId: 653; Part Status: Active; Price: 0.30; Series: NX8045GB; Size / Dimension: 0.315" L x 0.177" W (8.00mm x 4.50mm); Supplier 1: DigiKey; Supplier Part Number 1: 644-1018-1-ND; Type: MHz Crystal; Value: 8MHz
U1 = SCH - MICROCONTROLLER - STM32F429VET6TR: Supplier 1: Digi-Key

## Sheet Power-Supplies.SchDoc
size A3; Organization: Altium Limited; Address1: L3, 12a Rodborough Rd; Address2: Frenchs Forest; Address3: NSW; Address4: Australia 2086
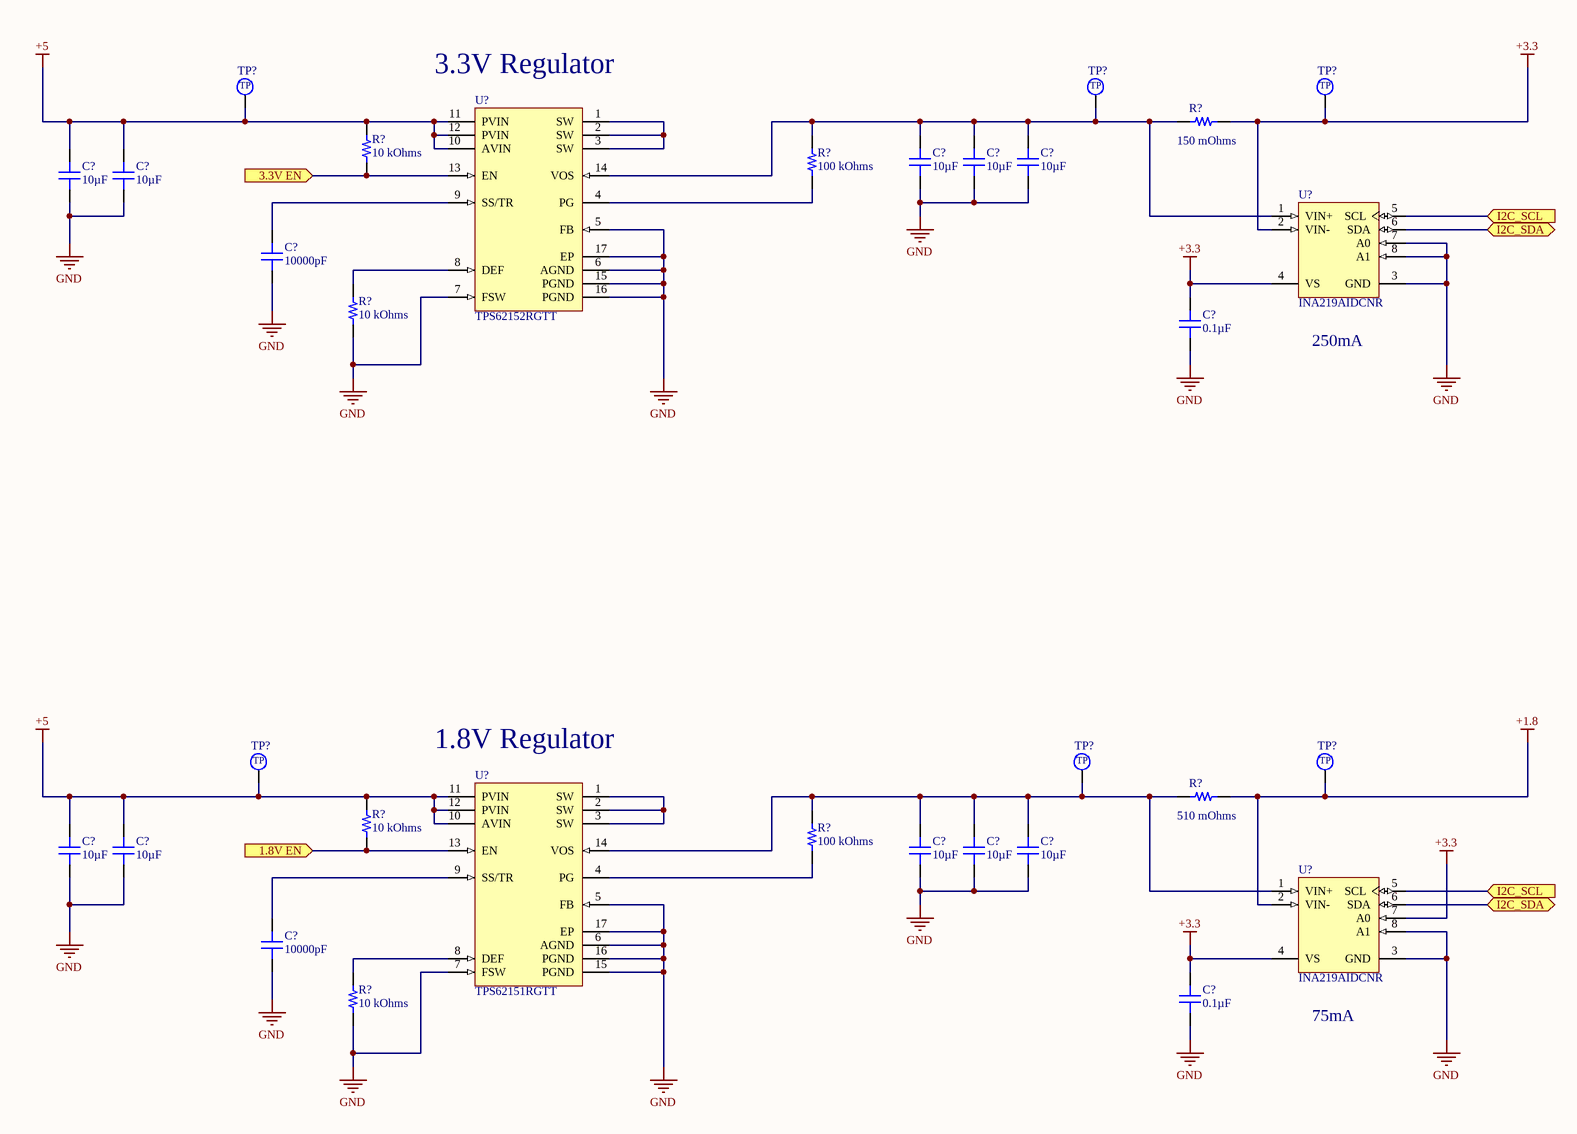
[diagram p2: Power-Supplies.SchDoc]

### Parts
(Parts that share a designator on the sheet are numbered #1, #2 ... from top to bottom, then left to right.)
C?#16  10µF  [CAP 0805_2012]
C?#17  10µF  [CAP 0805_2012]
C?#18  10µF  [CAP 0805_2012]
C?#19  10µF  [CAP 0805_2012]
C?#20  10µF  [CAP 0805_2012]
C?#21  10000pF  [CAP 0603_1608]
C?#22  0.1µF  [CAP 0603_1608]
C?#23  10µF  [CAP 0805_2012]
C?#24  10µF  [CAP 0805_2012]
C?#25  10µF  [CAP 0805_2012]
C?#26  10µF  [CAP 0805_2012]
C?#27  10µF  [CAP 0805_2012]
C?#28  10000pF  [CAP 0603_1608]
C?#29  0.1µF  [CAP 0603_1608]
R?#10  150 mOhms  [RES 0805_2012]
R?#11  10 kOhms  [RES 0603_1608]
R?#12  100 kOhms  [RES 0603_1608]
R?#13  10 kOhms  [RES 0603_1608]
R?#14  510 mOhms  [RES 0805_2012]
R?#15  10 kOhms  [RES 0603_1608]
R?#16  100 kOhms  [RES 0603_1608]
R?#17  10 kOhms  [RES 0603_1608]
TP?#3  2.5mm_SMD_TestPoint  [2.5mm TestPoint]  (value not drawn)
TP?#4  2.5mm_SMD_TestPoint  [2.5mm TestPoint]  (value not drawn)
TP?#5  2.5mm_SMD_TestPoint  [2.5mm TestPoint]  (value not drawn)
TP?#6  2.5mm_SMD_TestPoint  [2.5mm TestPoint]  (value not drawn)
TP?#7  2.5mm_SMD_TestPoint  [2.5mm TestPoint]  (value not drawn)
TP?#8  2.5mm_SMD_TestPoint  [2.5mm TestPoint]  (value not drawn)
U?#2  TPS62152RGTT  [RGT0016C_V]
U?#3  INA219AIDCNR  [DCN0008A_M]
U?#4  TPS62151RGTT  [RGT0016C_V]
U?#5  INA219AIDCNR  [DCN0008A_M]

### Ports
1.8V EN (in), 3.3V EN (in), I2C_SCL (in), I2C_SDA (bidir)

### Nets
+1.8: R?#14.2 TP?#8.1 U?#5.2(VIN-)
+3.3: C?#22.2 C?#29.2 R?#10.2 TP?#5.1 U?#3.2(VIN-) U?#3.4(VS) U?#5.4(VS) U?#5.7(A0)
+5: C?#19.2 C?#20.2 C?#23.2 C?#24.2 R?#11.2 R?#15.2 TP?#3.1 TP?#6.1 U?#2.10(AVIN) U?#2.11(PVIN) U?#2.12(PVIN) U?#4.10(AVIN) U?#4.11(PVIN) U?#4.12(PVIN)
GND: C?#16.1 C?#17.1 C?#18.1 C?#19.1 C?#20.1 C?#21.1 C?#22.1 C?#23.1 C?#24.1 C?#25.1 C?#26.1 C?#27.1 C?#28.1 C?#29.1 R?#13.1 R?#17.1 U?#2.5(FB) U?#2.6(AGND) U?#2.7(FSW) U?#2.15(PGND) U?#2.16(PGND) U?#2.17(EP) U?#3.3(GND) U?#3.7(A0) U?#3.8(A1) U?#4.5(FB) U?#4.6(AGND) U?#4.7(FSW) U?#4.15(PGND) U?#4.16(PGND) U?#4.17(EP) U?#5.3(GND) U?#5.8(A1)
NetC?#16_2: C?#16.2 C?#17.2 C?#18.2 R?#10.1 R?#12.2 TP?#4.1 U?#2.14(VOS) U?#3.1(VIN+)
NetC?#21_2: C?#21.2 U?#2.9(SS/TR)
NetC?#25_2: C?#25.2 C?#26.2 C?#27.2 R?#14.1 R?#16.2 TP?#7.1 U?#4.14(VOS) U?#5.1(VIN+)
NetC?#28_2: C?#28.2 U?#4.9(SS/TR)
NetR?#11_1: R?#11.1 U?#2.13(EN) ; port 3.3V EN
NetR?#12_1: R?#12.1 U?#2.4(PG)
NetR?#13_2: R?#13.2 U?#2.8(DEF)
NetR?#15_1: R?#15.1 U?#4.13(EN) ; port 1.8V EN
NetR?#16_1: R?#16.1 U?#4.4(PG)
NetR?#17_2: R?#17.2 U?#4.8(DEF)
NetU?#2_1: U?#2.1(SW) U?#2.2(SW) U?#2.3(SW)
NetU?#3_5: U?#3.5(SCL) U?#5.5(SCL) ; port I2C_SCL
NetU?#3_6: U?#3.6(SDA) U?#5.6(SDA) ; port I2C_SDA
NetU?#4_1: U?#4.1(SW) U?#4.2(SW) U?#4.3(SW)

### Notes on the sheet
- (near U?#2) 3.3V Regulator
- (near U?#3) 250mA
- (near U?#4) 1.8V Regulator
- (near U?#5) 75mA
- Title
- Size:
- Date:
- A3
- Number:
- Time:
- Revision:
- Sheet
- of
- File:
- (in symbol 2.5mm_SMD_TestPoint) TP

### Library data of the parts
C?#16-C?#20 C?#23-C?#27 = CC0805KKX5R7BB106: CAP CER 10UF 16V X5R 0805; Manufacturer: Yageo; Tolerance: ±10%; Part Number: CC0805KKX5R7BB106; Value: 10µF; Applications: General Purpose; Capacitance: 10µF; ComponentLink1Description: Datasheet; ComponentLink1URL: https://www.yageo.com/upload/media/product/productsearch/datasheet/mlcc/UPY-GPHC_X5R_4V-to-50V_25.pdf; ComponentLink2Description: DigiKey Link; ComponentLink2URL: http://digikey.com/product-detail/en/yageo/CC0805KKX5R7BB106/311-1865-1-ND/5195767; Device Package: 0805 (2012 Metric); LastUpdated: 9/2/2020 1:04:30 AM; Lifecycle Status: Active; Minimum Order: 1; Mounting Type: Surface Mount, MLCC; Operating Temperature: -55°C ~ 85°C; Package / Case: 0805 (2012 Metric); Packaging: TapeAndReel; PartId: 8867; Part Status: Active; Price: 0.09; Series: CC; Size / Dimension: 0.079" L x 0.049" W (2.00mm x 1.25mm); Supplier 1: DigiKey; Supplier Part Number 1: 311-1865-1-ND; Temperature Coefficient: X5R; Thickness (Max): 0.057" (1.45mm); Voltage - Rated: 16V
C?#21 C?#28 = C0603S103K4RACTU: CAP CER 10000PF 16V X7R 0603; Manufacturer: KEMET; Tolerance: ±10%; Part Number: C0603S103K4RACTU; Value: 10000pF; Applications: Boardflex Sensitive; Capacitance: 10000pF; ComponentLink1Description: Datasheet; ComponentLink1URL: https://api.kemet.com/component-edge/download/datasheet/C0603S103K4RACTU.pdf; ComponentLink2Description: DigiKey Link; ComponentLink2URL: http://digikey.com/product-detail/en/kemet/C0603S103K4RACTU/399-9135-1-ND/3522653; Device Package: 0603 (1608 Metric); Features: Floating Electrode; LastUpdated: 9/2/2020 1:03:34 AM; Lifecycle Status: Active; Minimum Order: 1; Mounting Type: Surface Mount, MLCC; Operating Temperature: -55°C ~ 125°C; Package / Case: 0603 (1608 Metric); Packaging: TapeAndReel; PartId: 3312; Part Status: Active; Price: 0.07; Series: SMD Comm X7R FE; Size / Dimension: 0.063" L x 0.031" W (1.60mm x 0.80mm); Supplier 1: DigiKey; Supplier Part Number 1: 399-9135-1-ND; Temperature Coefficient: X7R; Thickness (Max): 0.034" (0.87mm); Voltage - Rated: 16V
C?#22 C?#29 = VJ0603Y104KXJCW1BC: as C?#3 on sheet Microcontroller; Part Number: VJ0603Y104KXJCW1BC; Value: 0.1µF; Applications: General Purpose; Capacitance: 0.1µF; ComponentLink1Description: Datasheet; ComponentLink1URL: https://www.vishay.com/docs/28548/vjw1bcbascomseries.pdf; ComponentLink2Description: DigiKey Link; ComponentLink2URL: http://digikey.com/product-detail/en/vishay-vitramon/VJ0603Y104KXJCW1BC/720-1532-1-ND/421011; Device Package: 0603 (1608 Metric); LastUpdated: 9/2/2020 1:03:10 AM; Lifecycle Status: Active; Minimum Order: 1; Mounting Type: Surface Mount, MLCC; Operating Temperature: -55°C ~ 125°C; Package / Case: 0603 (1608 Metric); Packaging: TapeAndReel; PartId: 15347; Part Status: Active; Price: 0.03; Series: VJ; Size / Dimension: 0.063" L x 0.031" W (1.60mm x 0.80mm); Supplier 1: DigiKey; Supplier Part Number 1: 720-1532-1-ND; Temperature Coefficient: X7R; Thickness (Max): 0.035" (0.90mm); Voltage - Rated: 16V
R?#10 = KRL1220E-M-R150-F-T5: RES 0.15 OHM 1% 1/2W 0805; Manufacturer: Susumu; Power (Watts): 0.5W, 1/2W; Temperature Coefficient: ±50ppm/°C; Part Number: KRL1220E-M-R150-F-T5; Value: 150 mOhms; ComponentLink1Description: Datasheet; ComponentLink1URL: http://www.susumu.co.jp/common/pdf/n_catalog_partition09_en.pdf; ComponentLink2Description: DigiKey Link; ComponentLink2URL: http://digikey.com/product-detail/en/susumu/KRL1220E-M-R150-F-T5/408-1558-1-ND/3737740; Composition: Metal Foil; Device Package: 0805 (2012 Metric); Features: Automotive AEC-Q200, Current Sense; Height - Seated (Max): 0.028" (0.70mm); LastUpdated: 9/2/2020 1:14:36 AM; Lifecycle Status: Active; Minimum Order: 1; Number of Terminations: 2; Operating Temperature: -55°C ~ 155°C; Package / Case: 0805 (2012 Metric); Packaging: TapeAndReel; PartId: 47680; Part Status: Active; Price: 0.08; Ratings: AEC-Q200; Resistance: 150 mOhms; Series: KRL; Size / Dimension: 0.079" L x 0.049" W (2.00mm x 1.25mm); Supplier 1: DigiKey; Supplier Part Number 1: 408-1558-1-ND; Supplier Device Package: 0805; Tolerance: ±1%
R?#11 R?#13 R?#15 R?#17 = RMCF0603JT10K0: as R?#2 on sheet Payload-Card-Template; Part Number: RMCF0603JT10K0; Value: 10 kOhms; ComponentLink1Description: Datasheet; ComponentLink1URL: https://www.seielect.com/catalog/sei-packaging.pdf; ComponentLink2Description: DigiKey Link; ComponentLink2URL: http://digikey.com/product-detail/en/stackpole-electronics-inc/RMCF0603JT10K0/RMCF0603JT10K0CT-ND/1943191; Composition: Thick Film; Device Package: 0603 (1608 Metric); Features: Automotive AEC-Q200; Height - Seated (Max): 0.022" (0.55mm); LastUpdated: 8/30/2020 8:48:45 PM; Lifecycle Status: Active; Minimum Order: 1; Number of Terminations: 2; Operating Temperature: -55°C ~ 155°C; Package / Case: 0603 (1608 Metric); Packaging: CutTape; PartId: 25659; Part Status: Active; Price: 0.10; Ratings: AEC-Q200; Resistance: 10 kOhms; Series: RMCF; Size / Dimension: 0.061" L x 0.031" W (1.55mm x 0.80mm); Supplier 1: DigiKey; Supplier Part Number 1: RMCF0603JT10K0CT-ND; Supplier Device Package: 0603; Tolerance: ±5%
R?#12 R?#16 = RC0603JR-10100KL: RES SMD 100K OHM 5% 1/10W 0603; Manufacturer: Yageo; Power (Watts): 0.1W, 1/10W; Temperature Coefficient: ±100ppm/°C; Part Number: RC0603JR-10100KL; Value: 100 kOhms; ComponentLink1Description: Datasheet; ComponentLink1URL: https://www.yageo.com/upload/media/product/productsearch/datasheet/rchip/PYu-RC_Group_51_RoHS_L_10.pdf; ComponentLink2Description: DigiKey Link; ComponentLink2URL: http://digikey.com/product-detail/en/yageo/RC0603JR-10100KL/YAG2294CT-ND/5252408; Composition: Thick Film; Device Package: 0603 (1608 Metric); Features: Moisture Resistant; Height - Seated (Max): 0.022" (0.55mm); LastUpdated: 9/2/2020 1:10:22 AM; Lifecycle Status: Active; Minimum Order: 1; Number of Terminations: 2; Operating Temperature: -55°C ~ 155°C; Package / Case: 0603 (1608 Metric); Packaging: CutTape; PartId: 6071; Part Status: Active; Price: 0.10; Resistance: 100 kOhms; Series: RC; Size / Dimension: 0.063" L x 0.031" W (1.60mm x 0.80mm); Supplier 1: DigiKey; Supplier Part Number 1: YAG2294CT-ND; Supplier Device Package: 0603; Tolerance: ±5%
R?#14 = KDV08FR510ET: RES 510M OHM 1% 1/4W 0805; Manufacturer: Ohmite; Power (Watts): 0.25W, 1/4W; Temperature Coefficient: ±50ppm/°C; Part Number: KDV08FR510ET; Value: 510 mOhms; ComponentLink1Description: Datasheet; ComponentLink1URL: https://www.ohmite.com/assets/docs/res_kdv.pdf?r=false; ComponentLink2Description: DigiKey Link; ComponentLink2URL: http://digikey.com/product-detail/en/ohmite/KDV08FR510ET/273-KDV08FR510ETCT-ND/10476860; Composition: Metal Film; Device Package: 0805 (2012 Metric); Features: Current Sense; Height - Seated (Max): 0.026" (0.65mm); LastUpdated: 9/2/2020 1:14:56 AM; Lifecycle Status: Active; Minimum Order: 1; Number of Terminations: 2; Operating Temperature: -55°C ~ 155°C; Package / Case: 0805 (2012 Metric); Packaging: TapeAndReel; PartId: 40354; Part Status: Active; Price: 0.03; Resistance: 510 mOhms; Series: KDV; Size / Dimension: 0.079" L x 0.049" W (2.00mm x 1.25mm); Supplier 1: DigiKey; Supplier Part Number 1: 273-KDV08FR510ETCT-ND; Supplier Device Package: 0805; Tolerance: ±1%
U?#2 = CMP-0323-00129-3: Buck Step Down Regulator with 3 to 17 V Input and 3.3 V Output, -40 to 85 degC, 16-Pin QFN (RGT), Green (RoHS & no Sb/Br); Manufacturer: Texas Instruments; Rating: Catalog; Duty Cycle(Max)(%): 100; Regulated Outputs(#): 1; Preset Vout(V): 3.3; Vin(Max)(V): 17; Switch Current Limit(Typ)(A): 1.7; SubFamily: Step-Down Regulator; Iq(Typ)(mA): 0.017; Vin(Min)(V): 3; Synchronous Rectification: TRUE; PackageVersion: revH, Oct-2011; ComponentLink2Description: Package Specification; Code_JEDEC: MO-220; ComponentLink1Description: Datasheet; PackageDescription: 16-Pin Plastic Quad Flat No-Lead, 3 x 3 mm Body, 0.5 mm Pitch, 1.7 x 1.7 mm Exposed Pad; Iout(Max)(A): 1; Eco-Plan: Green (RoHS & no Sb/Br); PartNumber: TPS62152RGTT; Vout(Max)(V): 3.3; Topology: Buck; ComponentLink3URL: Samples URL:http://www.ti.com/product/tps54611#samples; ComponentLink2URL: http://www.ti.com/litv/pdf/mpqf119g; ComponentLink3Description: URL Link1; ComponentLink1URL: http://www.ti.com/general/docs/lit/getliterature.tsp?genericPartNumber=TPS62152&fileType=pdf; Vout(Min)(V): 3.3; Mounting Technology: Surface Mount; DatasheetVersion: SLVSAL5; PackageReference: RGT0016C
U?#3 U?#5 = CMP-0704-00041-2: Zero-Drift, Bi-directional Current / Power Monitor, 3 to 5.5 V, -40 to 125 degC, 8-pin SOP (DCN8), Green (RoHS & no Sb/Br); Manufacturer: Texas Instruments; Input Offset (+/-)(Max)(uV): 100; Small-Signal Bandwidth(Typ)(MHz): 0.011; SubFamily: Current Shunt Monitor; Rating: Catalog; Quiescent Current (+/-)(Typ)(mA): 0.7; Vs(Max)(V): 5.5; Common Mode Range(Min)(V): 0; Vs(Min)(V): 3; Common Mode Range(Max)(V): 26; Gain(V/V): 1, 0.5, 0.25, 0.125; ComponentLink3URL: http://www.ti.com/lit/ml/mpds099c/mpds099c.pdf; ComponentLink2URL: http://www.ti.com/general/docs/lit/getliterature.tsp?genericPartNumber=INA219&fileType=pdf; PackageReference: DCN0008A; ComponentLink1URL: http://www.ti.com/; ComponentLink1Description: Manufacturer URL; Code_JEDEC: MO-178; CMRR(Min)(dB): 100; DatasheetVersion: SBOS448F; Mounting Technology: Surface Mount; ComponentLink3Description: Package Specification; PartNumber: INA219AIDCNR; PackageVersion: 4202106/D, 11/2009; Eco-Plan: Green (RoHS & no Sb/Br); ComponentLink2Description: Datasheet; PackageDescription: 8-Pin Plastic Small Outline, Body 1.6 x 2.9 mm, Pitch 0.65 mm
U?#4 = CMP-0323-00124-3: Buck Step Down Regulator with 3 to 17 V Input and 1.8 V Output, -40 to 85 degC, 16-Pin QFN (RGT), Green (RoHS & no Sb/Br); Manufacturer: Texas Instruments; Vin(Min)(V): 3; Duty Cycle(Max)(%): 90; SubFamily: Step-Down Regulator; Iq(Typ)(mA): 0.017; Regulated Outputs(#): 1; Vout(Max)(V): 1.8; Switch Current Limit(Typ)(A): 1.7; Synchronous Rectification: TRUE; Vin(Max)(V): 17; Rating: Catalog; ComponentLink2Description: Package Specification; ComponentLink2URL: http://www.ti.com/litv/pdf/mpqf119g; Code_JEDEC: MO-220; DatasheetVersion: SLVSAL5; Mounting Technology: Surface Mount; PartNumber: TPS62151RGTT; ComponentLink1Description: Datasheet; Eco-Plan: Green (RoHS & no Sb/Br); ComponentLink1URL: http://www.ti.com/general/docs/lit/getliterature.tsp?genericPartNumber=TPS62151&fileType=pdf; Iout(Max)(A): 1; PackageDescription: 16-Pin Plastic Quad Flat No-Lead, 3 x 3 mm Body, 0.5 mm Pitch, 1.7 x 1.7 mm Exposed Pad; ComponentLink3Description: URL Link1; Topology: Buck; ComponentLink3URL: Samples URL:http://www.ti.com/product/tps54611#samples; PackageVersion: revH, Oct-2011; Vout(Min)(V): 1.8; Preset Vout(V): 1.8; PackageReference: RGT0016C

## Nets that join several sheets
+3.3: Payload-Card-Template (C?#1.2 J?#1.5), Microcontroller (7 pins), Power-Supplies (8 pins)
+5: Payload-Card-Template (5 pins), Power-Supplies (14 pins)
GND: Payload-Card-Template (23 pins), Microcontroller (6 pins), Power-Supplies (33 pins)